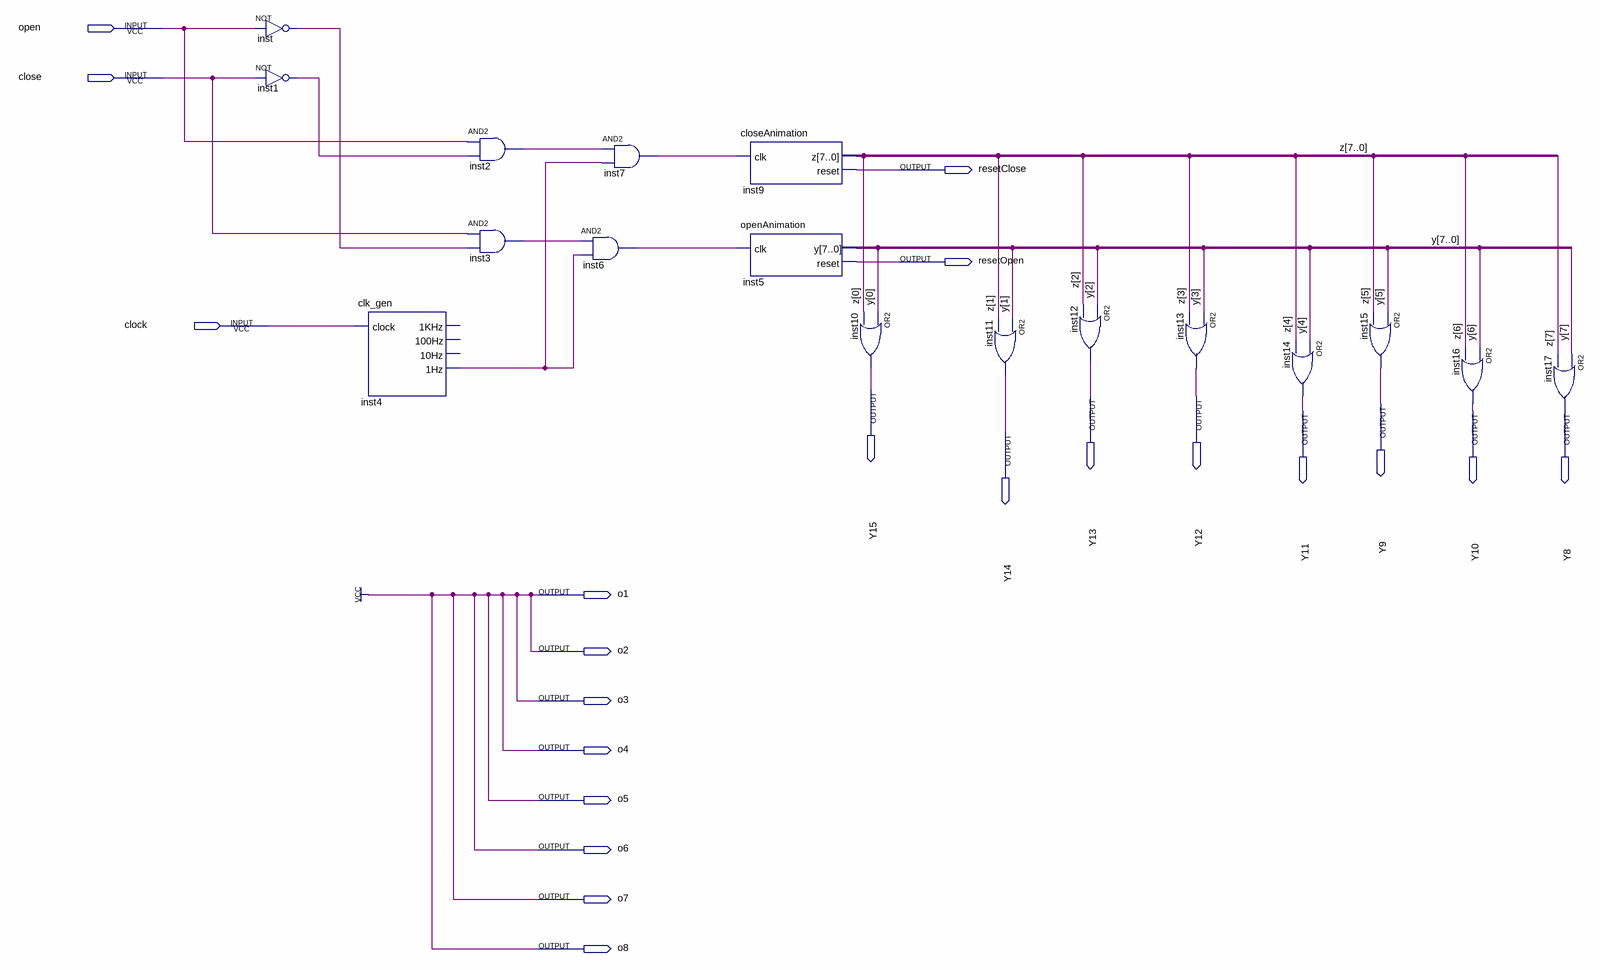
[diagram p0: schematic sheet]
// Quartus schematic doorControl.bdf as structural Verilog: 17 symbols, 21 pins
module doorControl (
  input  open,
  input  close,
  input  clock,
  output resetClose,
  output resetOpen,
  output Y15,
  output Y13,
  output Y12,
  output Y9,
  output Y11,
  output Y10,
  output Y8,
  output Y14,
  output o1,
  output o2,
  output o3,
  output o4,
  output o5,
  output o6,
  output o7,
  output o8
);

  wire inst1_out, inst2_out, inst3_out, inst4_1hz, inst6_out, inst7_out, inst_out;
  wire [7:0] y, z;

  not inst (inst_out, open);
  not inst1 (inst1_out, close);
  clk_gen inst4 (.clock(clock), .\1Hz (inst4_1hz));  // open: 1KHz, 100Hz, 10Hz
  and inst2 (inst2_out, open, inst1_out);
  and inst3 (inst3_out, close, inst_out);
  and inst6 (inst6_out, inst3_out, inst4_1hz);
  and inst7 (inst7_out, inst2_out, inst4_1hz);
  closeAnimation inst9 (.clk(inst7_out), .z(z), .reset(resetClose));
  openAnimation inst5 (.clk(inst6_out), .y(y), .reset(resetOpen));
  or inst10 (Y15, y[0], z[0]);
  or inst11 (Y14, y[1], z[1]);
  or inst12 (Y13, y[2], z[2]);
  or inst13 (Y12, y[3], z[3]);
  or inst14 (Y11, y[4], z[4]);
  or inst15 (Y9, y[5], z[5]);
  or inst16 (Y10, y[6], z[6]);
  or inst17 (Y8, y[7], z[7]);

  assign o1 = 1'b1;
  assign o2 = 1'b1;
  assign o3 = 1'b1;
  assign o4 = 1'b1;
  assign o5 = 1'b1;
  assign o6 = 1'b1;
  assign o7 = 1'b1;
  assign o8 = 1'b1;
endmodule
